# EAGLE design pcb (EAGLE 7.5.0)
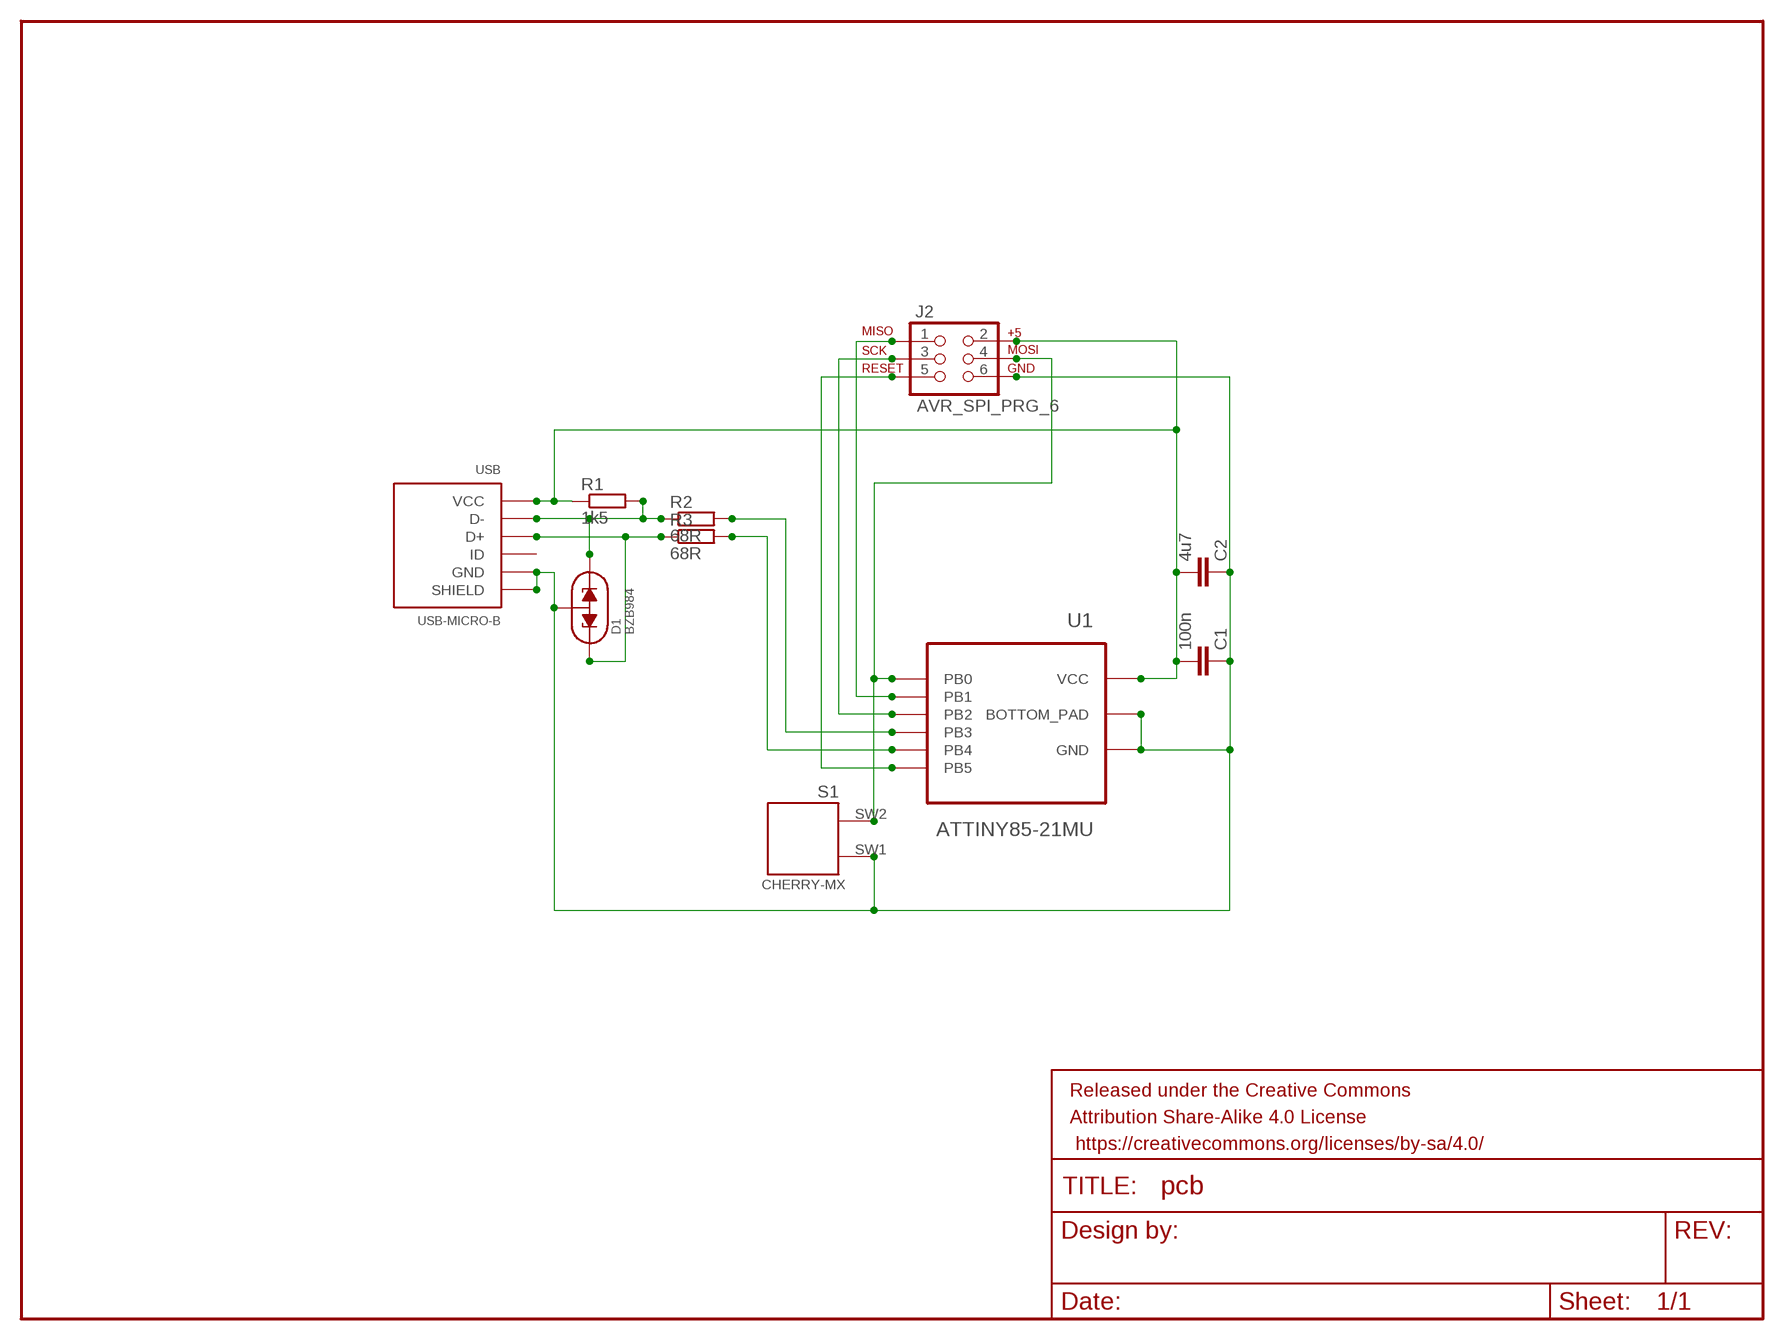
[diagram p0: schematic, sheet 1]

## Parts
C1  100n  C-EUC0603  [C0603]
C2  4u7  C-EUC0603  [C0603]
D1  BZB984  [SOT663]
FRAME1  FRAME-LETTERNO_PACKAGE  [DUMMY]
J2  AVR_SPI_PRG_6  [2X3_PADS]
R1  1k5  R-EU_R0603  [R0603]
R2  68R  R-EU_R0603  [R0603]
R3  68R  R-EU_R0603  [R0603]
S1  CHERRY-MX-PLATE  [CHERRY-MX-PLATE]
U1  ATTINY85-21MU  [QFN-20-4MM]
USB  USB-MICRO-B  [MICRO-USB-B]

## Nets
D+: R3.2 U1.5(PB4)
D-: R2.2 U1.2(PB3)
GND: C1.1 C2.1 D1.3(ANODE) J2.6 S1.SW1(PIN-1) U1.8(GND) U1.21(BOTTOM_PAD) USB.5(GND) USB.P$1(SHIELD) USB.P$2(SHIELD) USB.P$3(SHIELD) USB.P$4(SHIELD) USB.SHIELD1(SHIELD) USB.SHIELD2(SHIELD) USB.SHIELD3(SHIELD) USB.SHIELD3A(SHIELD) USB.SHIELD4(SHIELD) USB.SHIELD5(SHIELD) USB.SHIELD6(SHIELD) USB.SHIELD6A(SHIELD)
N$1: J2.1 U1.12(PB1)
N$2: J2.4 S1.SW2(PIN-2) U1.11(PB0)
N$3: J2.3 U1.14(PB2)
N$5: D1.2(CATHODE2) R1.2 R2.1 USB.2(D-)
N$7: D1.1(CATHODE1) R3.1 USB.3(D+)
N$8: C1.2 C2.2 J2.2 R1.1 U1.15(VCC) USB.1(VCC)
N$10: J2.5 U1.1(PB5)
Unconnected: USB.4(ID)

## Library data of the parts
C1 C2 = resistor:C-EU: CAPACITOR, European symbol
D1 = my-library:BZB984: NXP BZB984 series Voltage regulator double diodes Low-power voltage regulator diodes in a SOT663 ultra small plastic SMD package.
FRAME1 = SparkFun-Aesthetics:FRAME-LETTER: Schematic Frame Standard 8.5x11 US Letter frame; DESIGNER: Nobody; VERSION: v01
J2 = SparkFun-Connectors:AVR_SPI_PRG_6: AVR ISP 6 Pin This is the reduced ISP connector for AVR programming. Common on Arduino. This footprint will take up less PCB space and can be used with a 10-pin to 6-pin adapter such as SKU: BOB-08508 **Special note about "TEST_POINT" package. The stop mask is on the top side, so if you want your programming test points to be on the bottom of your board, make sure to place this package on the bottom side of the board. This also ensure that the orientation to program from the bottom side will be correct.
R1-R3 = resistor:R-EU_: RESISTOR, European symbol
S1 = cherrymx:CHERRY-MX-PLATE: Plate-mounted Cherry MX series keyswitch
U1 = Atmel_By_element14_Batch_1-00:ATTINY85-21MU
USB = my-library:USB-MICRO-B

## Board
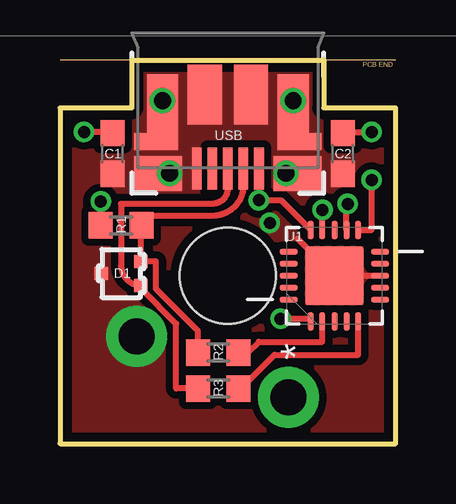
[diagram p1: board, top side]
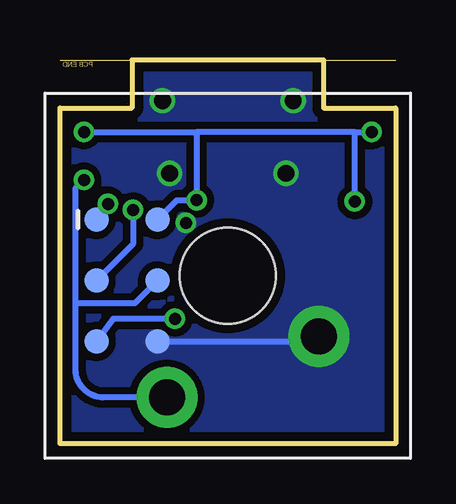
[diagram p2: board, bottom side, seen from below]

Size 14 x 16 mm. Coordinates in mm from the lower left corner, seen from the top.
Outline: 0,0 14,0 14,14 11,14 11,16 3,16 3,14 0,14 0,0
Copper layers (1*16): Top 0.0356mm / dielectric 1.5011mm / Bottom 0.0356mm
Design rules "oshpark-2layer-modified": minimum track width 6mil, minimum drill 13mil, track to track 6mil, track to pad 6mil, pad to pad 6mil, via to via 6mil, smd to smd 0mil, copper to edge 15mil, drill to drill 6mil, minimum pad ring 7mil, minimum via ring 7mil, stop-mask expansion 2.5mil, vias tented up to drill 25mil, thermal gap 10mil

### Footprints (pad centres in the part's own frame; a part is rotated, then mirrored left to right if it is on the bottom)
C0603 = smd 1.1 x 1: 1 -0.85,0; 2 0.85,0
SOT663 = smd 0.55 x 0.55: 1 0.825,-0.5; 2 0.825,0.5; 3 -0.825,0
2X3_PADS = smd 1.016 x 1.016: 1 -2.54,-1.27; 2 -2.54,1.27; 3 0,-1.27; 4 0,1.27; 5 2.54,-1.27; 6 2.54,1.27
R0603 = smd 1 x 1.1: 1 -0.85,0; 2 0.85,0
CHERRY-MX-PLATE = drill 1.5 pad 2.54: SW1 -3.81,2.54; SW2 2.54,5.08 | hole 4: 0,0
QFN-20-4MM = smd 0.762 x 0.254: 1 -1.905,0.991; 2 -1.905,0.508; 3 -1.905,0; 4 -1.905,-0.508; 5 -1.905,-0.991; 11 1.905,-0.991; 12 1.905,-0.508; 13 1.905,0; 14 1.905,0.508; 15 1.905,0.991 | smd 0.254 x 0.762: 6 -0.991,-1.905; 7 -0.508,-1.905; 8 0,-1.905; 9 0.508,-1.905; 10 0.991,-1.905; 16 0.991,1.905; 17 0.508,1.905; 18 0,1.905; 19 -0.508,1.905; 20 -0.991,1.905 | smd 2.438 x 2.438: 21 0,0
MICRO-USB-B = smd 0.4 x 1.75: 1 -1.3,2.825; 2 -0.65,2.825; 3 0,2.825; 4 0.65,2.825; 5 1.3,2.825 | drill 0.7: P$1 -2.725,0; P$2 -2.425,3.03; P$3 2.425,3.03; P$4 2.725,0 | smd 2 x 1.46: SHIELD1 -2.9,3.03; SHIELD2 2.9,3.03 | smd 1.3 x 3.15: SHIELD3 -2.725,0.475; SHIELD6 2.725,0.475 | smd 0.525 x 0.7: SHIELD3A -3.638,1.7; SHIELD6A 3.638,1.7 | smd 1.425 x 2.5: SHIELD4 -0.963,-0.25; SHIELD5 0.963,-0.25

### Placement (x,y rotation side)
C1  2.2,12.1 90 top
C2  11.8,12.1 90 top
D1  2.55,7.1 0 top
FRAME1  -3,-3 0 top
J2  11.2,6.8 270 bottom
R1  2.55,9.1 0 top
R2  6.6,3.8 0 top
R3  6.6,2.3 0 top
S1  7,7 180 bottom
U1  11.45,7 90 top
USB  7,14.3 180 top

### Tracks (layer width: path | path; a pad name or v marks a point on that pad's centre or on a via)
D+
  Top 0.254: U1.5 12.44,3.7 8.95,3.7 7.55,2.3 R3.2
D-
  Top 0.254: 10.94,4.84 U1.2 10.94,4.25 8.3,4.25 7.85,3.8 R2.2
GND  (via drill 0.5)
  Top 0.254: U1.8 U1.21 9.9,8.55
  Bottom 0.254: J2.6 3.39,4.26 S1.SW1
  other vias: 8.75,9.2
  pour Bottom (isolate 0.3, no thermals): 0,14 3,14 3,16 11,16 11,14 14,14 14,0 0,0
  pour Top (isolate 0.3, no thermals): 0,14 3,14 3,16 11,16 11,14 14,14 14,0 0,0
N$1  (via drill 0.5)
  Top 0.254: U1.12 11.96,10 v12,10
  Bottom 0.254: J2.1 12.47,9.53 v12,10
N$2  (via drill 0.5)
  Top 0.254: U1.11 13,8.91 v13,11
  Bottom 0.254: J2.4 10.88,5.85 13.35,5.85 | S1.SW2 12.23,1.92 arc90 13.35,3.19 13.35,5.85 | 13.35,5.85 13.35,10.65 v13,11
N$3  (via drill 0.5)
  Top 0.254: U1.14 v10.94,9.75 v10.95,9.75
  Bottom 0.254: v10.95,9.75 10.95,8.32 J2.3
N$5
  Top 0.254: USB.2 7.65,10.77 arc-90 6.38,9.5 3.4,9.5 R1.2 3.38,9.1 D1.2 4,7.6 4,6.45 5.75,4.7 R2.1
N$7
  Top 0.254: USB.3 7,10.63 arc-90 6.37,10 2.55,10 2.55,7.43 arc90 D1.1 3.38,6.47 4.85,5 4.85,2.3 R3.1
N$8  (via drill 0.5)
  Top 0.254: USB.1 v8.3,10.15 9.21,10.15 U1.15 | C2.2 11.85,13 v13,13 | C1.2 2.15,13 v1,13 | R1.1 v1.7,10.1
  Bottom 0.254: J2.2 9.12,10.15 v8.3,10.15 8.3,13 | v13,13 8.3,13 | 1.7,13 8.3,13 | v1.7,10.1 1.7,13 | 1.7,13 v1,13
N$10  (via drill 0.5)
  Top 0.254: U1.1 10.46,5.2 v9.2,5.2
  Bottom 0.254: v9.2,5.2 11.78,5.2 J2.5